# Altium schematic sheet UART_BUFFER.SchDoc
size A4; SheetNumber: 10; SheetTotal: 10
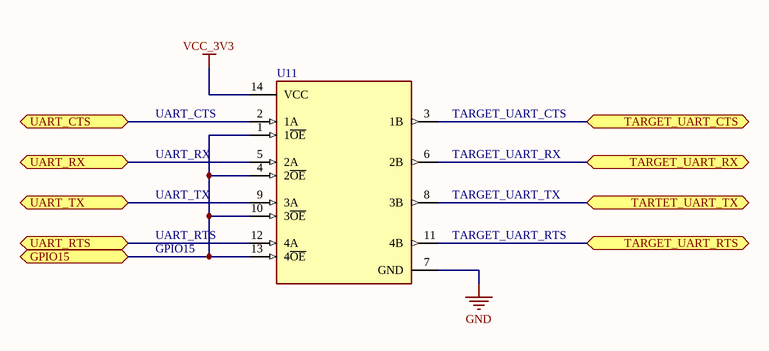
[diagram p0: UART_BUFFER.SchDoc]

## Parts
U11  SN74CBTLV3125PWR  [FP-PW0014A-IPC_B]  (value not drawn)

## Ports
GPIO15 (bidir), TARGET_UART_CTS (bidir), TARGET_UART_RTS (bidir), TARGET_UART_RX (bidir), TARTET_UART_TX (bidir), UART_CTS (bidir), UART_RTS (bidir), UART_RX (bidir), UART_TX (bidir)

## Nets
GND: U11.7(GND)
VCC_3V3: U11.14(VCC)
GPIO15: U11.1(1~{OE}) U11.4(2~{OE}) U11.10(3~{OE}) U11.13(4~{OE}) ; port GPIO15
TARGET_UART_CTS: U11.3(1B) ; port TARGET_UART_CTS
TARGET_UART_RTS: U11.11(4B) ; port TARGET_UART_RTS
TARGET_UART_RX: U11.6(2B) ; port TARGET_UART_RX
TARTET_UART_TX: U11.8(3B) ; port TARTET_UART_TX
UART_CTS: U11.2(1A) ; port UART_CTS
UART_RTS: U11.12(4A) ; port UART_RTS
UART_RX: U11.5(2A) ; port UART_RX
UART_TX: U11.9(3A) ; port UART_TX

## Notes on the sheet
- UART_CTS
- (near U11) TARGET_UART_CTS
- UART_RX
- UART_TX
- (near U11) TARGET_UART_RX
- (near U11) TARGET_UART_TX
- UART_RTS
- GPIO15
- (near U11) TARGET_UART_RTS

## Library data of the parts
U11 = CMP-04897-000014-1: IC BUS SWITCH 1 X 1:1 14TSSOP; On-State Resistance: 7R; Output Current: 64mA; Supply Type: Single; Nominal Supply Current: 10uA; Min Supply Voltage: 2.3V; Number of Elements: 4; Polarity: Non-Inverting; Bandwidth: 200MHz; Throw Configuration: SPST; High Level Output Current: -128mA; Low Level Output Current: 128mA; Max Supply Voltage: 3.6V; Turn-On Delay Time: 4.6ns; Operating Supply Voltage: 3.3V; Max Operating Temperature: 85°C; Min Operating Temperature: -40°C; Lead Free: Lead Free; Supply Current: 10uA; RoHS Compliant: Yes; Contact Plating: Gold; Radiation Hardening: No; Packaging: Tape and Reel; Series: 74CBTLV; Weight: 0.002018oz; Number of Channels: 4; Number of Pins: 14; Mount: Surface Mount; Number of Switches: 4; Quiescent Current: 10uA; Technology: CMOS; Independent Circuits: 4; Case/Package: TSSOP; Package Quantity: 1; REACH SVHC: No SVHC; Number of Bits: 4; Propagation Delay: 4.6ns